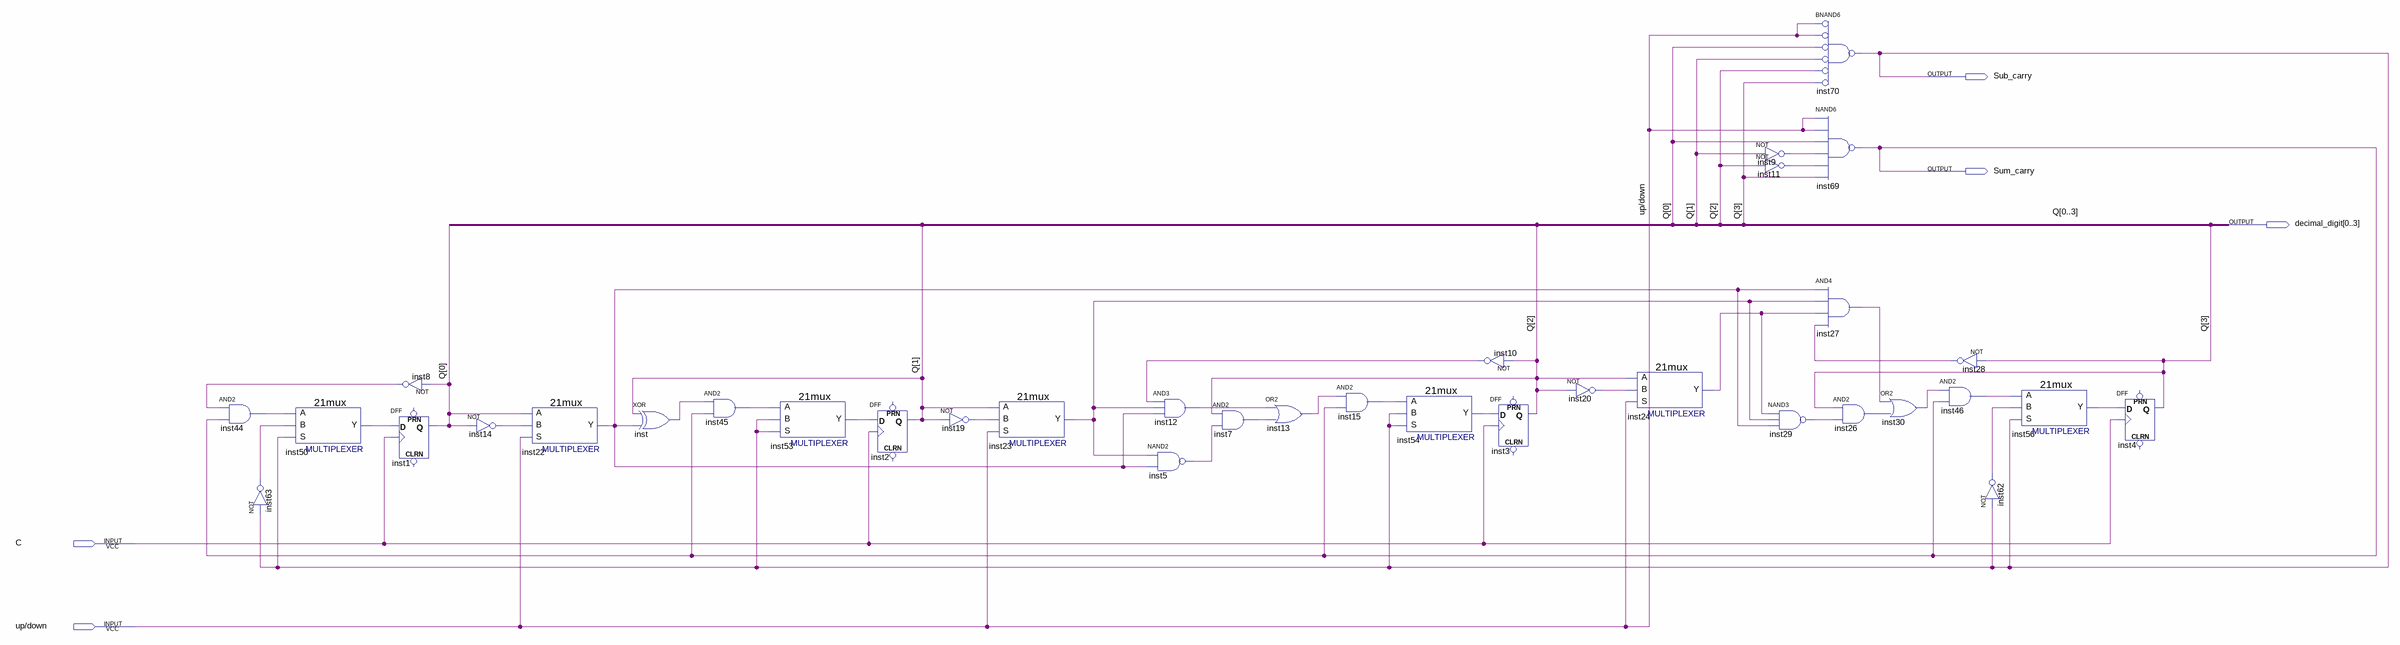
[diagram p0: schematic sheet]
// Quartus schematic SyncCNT.bdf as structural Verilog: 36 symbols, 5 pins
module SyncCNT (
  input  C,
  input  \up/down ,
  output Sub_carry,
  output Sum_carry,
  output [0:3] decimal_digit
);

  wire inst5_out, inst7_out, inst8_out, inst9_out, inst10_out, inst11_out, inst12_out, inst13_out,
       inst14_out, inst15_out, inst19_out, inst20_out, inst22_y, inst23_y, inst24_y, inst26_out, inst27_out,
       inst28_out, inst29_out, inst30_out, inst44_out, inst45_out, inst46_out, inst50_y, inst53_y, inst54_y,
       inst56_y, inst62_out, inst63_out, inst_out;

  and inst44 (inst44_out, inst8_out, Sum_carry);
  \21mux  inst50 (.S(Sub_carry), .B(inst63_out), .A(inst44_out), .Y(inst50_y));
  not inst63 (inst63_out, Sub_carry);
  not inst8 (inst8_out, decimal_digit[0]);
  DFF inst1 (.CLK(C), .D(inst50_y), .Q(decimal_digit[0]));  // open: CLRN, PRN
  not inst14 (inst14_out, decimal_digit[0]);
  \21mux  inst22 (.S(\up/down ), .B(inst14_out), .A(decimal_digit[0]), .Y(inst22_y));
  xor inst (inst_out, decimal_digit[1], inst22_y);
  and inst45 (inst45_out, inst_out, Sum_carry);
  \21mux  inst53 (.S(Sub_carry), .B(Sub_carry), .A(inst45_out), .Y(inst53_y));
  DFF inst2 (.CLK(C), .D(inst53_y), .Q(decimal_digit[1]));  // open: CLRN, PRN
  not inst19 (inst19_out, decimal_digit[1]);
  \21mux  inst23 (.S(\up/down ), .B(inst19_out), .A(decimal_digit[1]), .Y(inst23_y));
  and inst12 (inst12_out, inst10_out, inst23_y, inst22_y);
  nand inst5 (inst5_out, inst23_y, inst22_y);
  and inst7 (inst7_out, decimal_digit[2], inst5_out);
  or inst13 (inst13_out, inst12_out, inst7_out);
  and inst15 (inst15_out, inst13_out, Sum_carry);
  \21mux  inst54 (.S(Sub_carry), .B(Sub_carry), .A(inst15_out), .Y(inst54_y));
  not inst10 (inst10_out, decimal_digit[2]);
  DFF inst3 (.CLK(C), .D(inst54_y), .Q(decimal_digit[2]));  // open: CLRN, PRN
  not inst20 (inst20_out, decimal_digit[2]);
  \21mux  inst24 (.S(\up/down ), .B(inst20_out), .A(decimal_digit[2]), .Y(inst24_y));
  not inst9 (inst9_out, decimal_digit[1]);
  not inst11 (inst11_out, decimal_digit[2]);
  nand inst29 (inst29_out, inst24_y, inst23_y, inst22_y);
  nand inst70 (Sub_carry, ~\up/down , ~\up/down , ~decimal_digit[0], ~decimal_digit[1], ~decimal_digit[2], ~decimal_digit[3]);  // BNAND6
  nand inst69 (Sum_carry, \up/down , \up/down , decimal_digit[0], inst9_out, inst11_out, decimal_digit[3]);
  and inst27 (inst27_out, inst22_y, inst23_y, inst24_y, inst28_out);
  and inst26 (inst26_out, decimal_digit[3], inst29_out);
  or inst30 (inst30_out, inst27_out, inst26_out);
  and inst46 (inst46_out, inst30_out, Sum_carry);
  not inst28 (inst28_out, decimal_digit[3]);
  not inst62 (inst62_out, Sub_carry);
  \21mux  inst56 (.S(Sub_carry), .B(inst62_out), .A(inst46_out), .Y(inst56_y));
  DFF inst4 (.CLK(C), .D(inst56_y), .Q(decimal_digit[3]));  // open: CLRN, PRN

  // Other names for the same wires on the sheet: Q[3:0] = {decimal_digit[3], decimal_digit[2], decimal_digit[1], decimal_digit[0]}
endmodule
